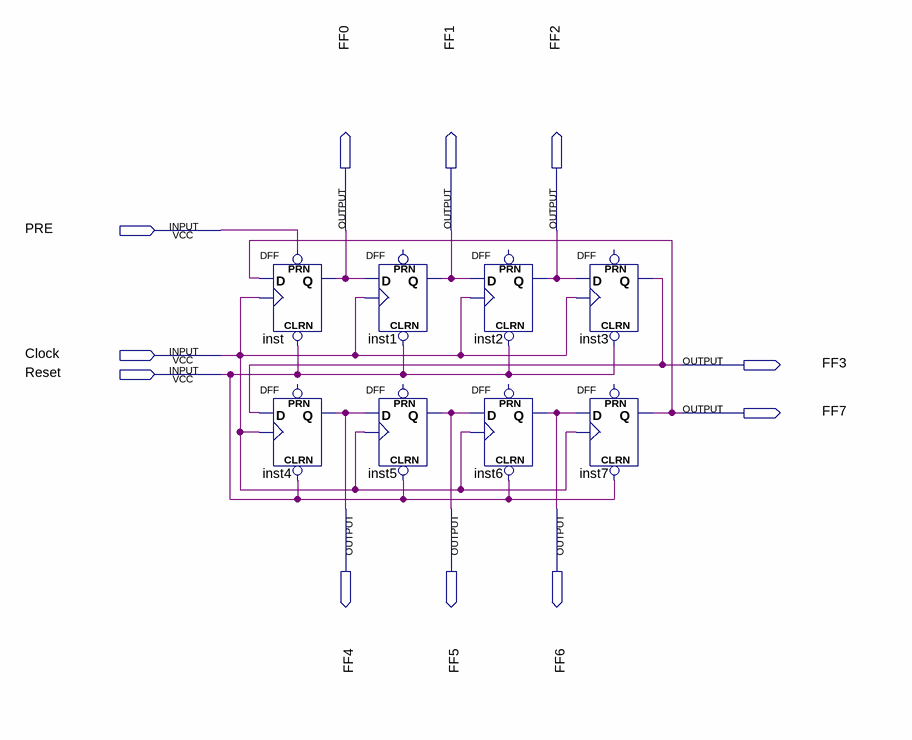
[diagram p0: schematic sheet]
// Quartus schematic ContadorAnillo.bdf as structural Verilog: 8 symbols, 11 pins
module ContadorAnillo (
  input  PRE,
  input  Clock,
  input  Reset,
  output FF0,
  output FF1,
  output FF2,
  output FF3,
  output FF7,
  output FF4,
  output FF5,
  output FF6
);

  DFF inst (.CLRN(Reset), .CLK(Clock), .D(FF7), .PRN(PRE), .Q(FF0));
  DFF inst4 (.CLRN(Reset), .CLK(Clock), .D(FF3), .Q(FF4));  // open: PRN
  DFF inst1 (.CLRN(Reset), .CLK(Clock), .D(FF0), .Q(FF1));  // open: PRN
  DFF inst5 (.CLRN(Reset), .CLK(Clock), .D(FF4), .Q(FF5));  // open: PRN
  DFF inst2 (.CLRN(Reset), .CLK(Clock), .D(FF1), .Q(FF2));  // open: PRN
  DFF inst6 (.CLRN(Reset), .CLK(Clock), .D(FF5), .Q(FF6));  // open: PRN
  DFF inst3 (.CLRN(Reset), .CLK(Clock), .D(FF2), .Q(FF3));  // open: PRN
  DFF inst7 (.CLRN(Reset), .CLK(Clock), .D(FF6), .Q(FF7));  // open: PRN
endmodule
